# Altium project BMS Slave Device R1.5.PrjPcb
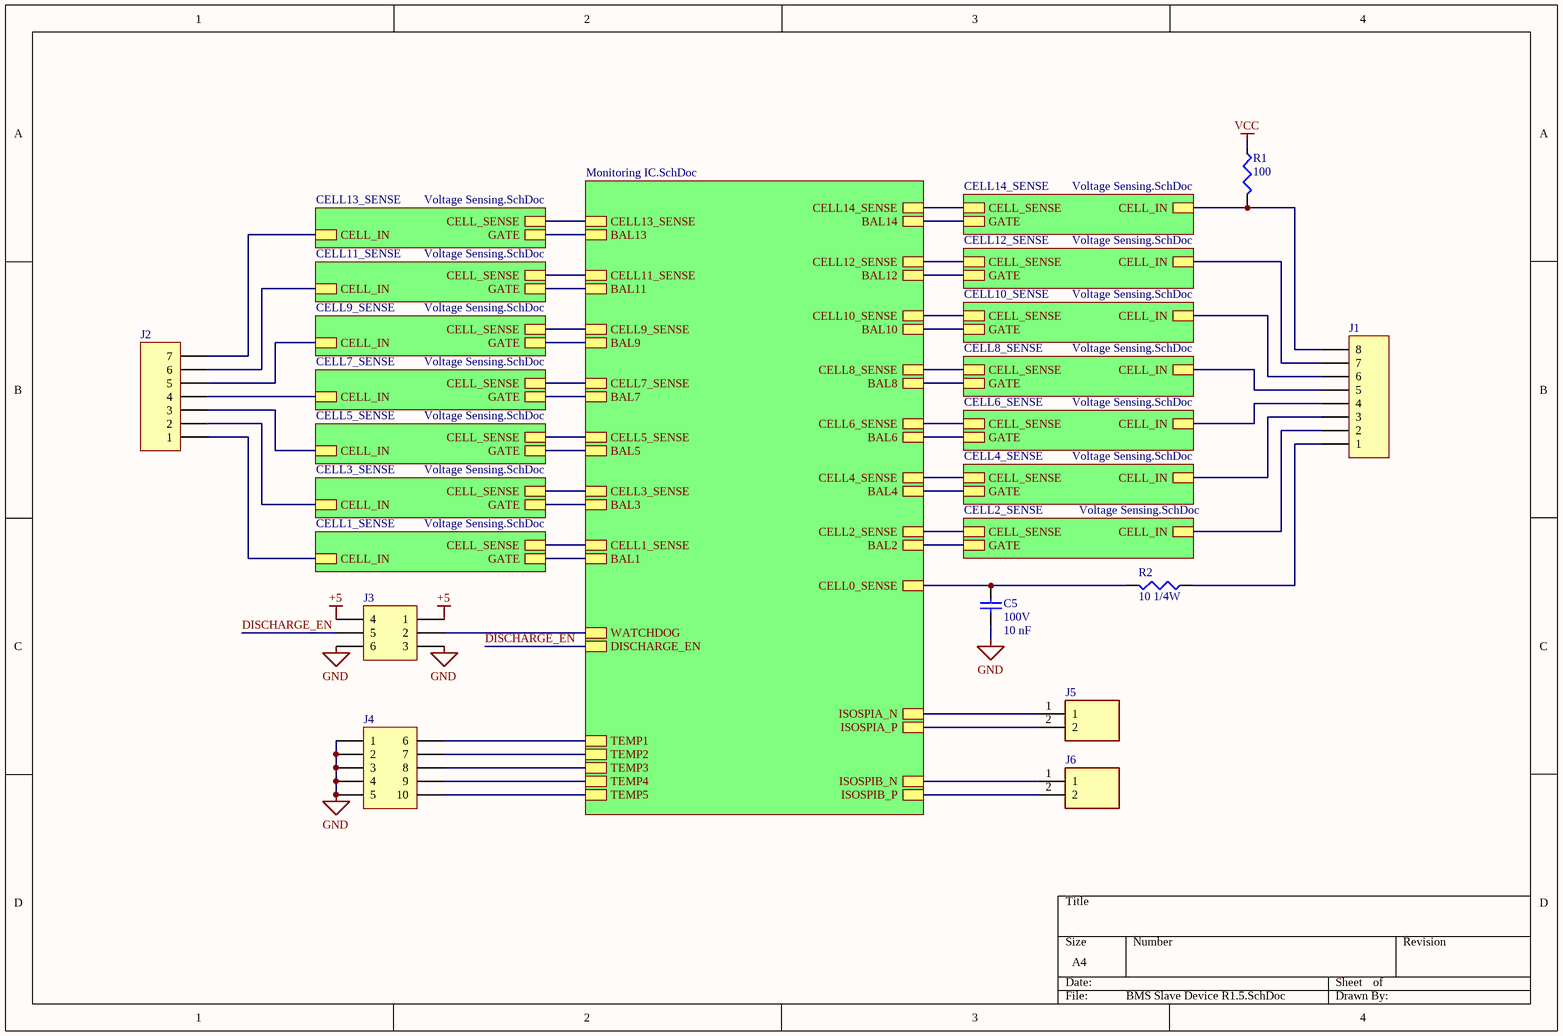
[diagram p0: BMS Slave Device R1.5.SchDoc]
2 sheets, 79 parts. Net scope: hierarchical (ports join the sheet entries above them; power ports are global).
Board file: BMS Slave Device R1.5.PcbDoc
Sheets:
  BMS Slave Device R1.5.SchDoc
    CELL14_SENSE = Voltage Sensing.SchDoc
    CELL12_SENSE = Voltage Sensing.SchDoc
    CELL10_SENSE = Voltage Sensing.SchDoc
    CELL8_SENSE = Voltage Sensing.SchDoc
    CELL6_SENSE = Voltage Sensing.SchDoc
    CELL4_SENSE = Voltage Sensing.SchDoc
    CELL2_SENSE = Voltage Sensing.SchDoc
    CELL13_SENSE = Voltage Sensing.SchDoc
    CELL11_SENSE = Voltage Sensing.SchDoc
    CELL9_SENSE = Voltage Sensing.SchDoc
    CELL7_SENSE = Voltage Sensing.SchDoc
    CELL5_SENSE = Voltage Sensing.SchDoc
    CELL3_SENSE = Voltage Sensing.SchDoc
    CELL1_SENSE = Voltage Sensing.SchDoc

## Sheet BMS Slave Device R1.5.SchDoc
size A4

### Parts
C5  100V  value 10 nF  [6-0805_N]
J1  Header 8  [HDR1X8]  (value not drawn)
J2  ODD CELLS  [HDR1X7]  (value not drawn)
J3  (no value)  [HDR2X3_CEN]
J4  THERMISTORS  [HDR2X5_CEN]  (value not drawn)
J5  B2B-XH-2__LF__SN_  [B2BXH2LFSN]  (value not drawn)
J6  B2B-XH-2__LF__SN_  [B2BXH2LFSN]  (value not drawn)
R1  value 100  [J1-0603]  (hidden comment: Res3)
R2  value 10 1/4W  [C1206]

### Sub-sheets
CELL1_SENSE = Voltage Sensing.SchDoc: CELL_SENSE, CELL_IN, GATE
CELL2_SENSE = Voltage Sensing.SchDoc: CELL_SENSE, CELL_IN, GATE
CELL3_SENSE = Voltage Sensing.SchDoc: CELL_SENSE, CELL_IN, GATE
CELL4_SENSE = Voltage Sensing.SchDoc: CELL_SENSE, CELL_IN, GATE
CELL5_SENSE = Voltage Sensing.SchDoc: CELL_SENSE, CELL_IN, GATE
CELL6_SENSE = Voltage Sensing.SchDoc: CELL_SENSE, CELL_IN, GATE
CELL7_SENSE = Voltage Sensing.SchDoc: CELL_SENSE, CELL_IN, GATE
CELL8_SENSE = Voltage Sensing.SchDoc: CELL_SENSE, CELL_IN, GATE
CELL9_SENSE = Voltage Sensing.SchDoc: CELL_SENSE, CELL_IN, GATE
CELL10_SENSE = Voltage Sensing.SchDoc: CELL_SENSE, CELL_IN, GATE
CELL11_SENSE = Voltage Sensing.SchDoc: CELL_SENSE, CELL_IN, GATE
CELL12_SENSE = Voltage Sensing.SchDoc: CELL_SENSE, CELL_IN, GATE
CELL13_SENSE = Voltage Sensing.SchDoc: CELL_SENSE, CELL_IN, GATE
CELL14_SENSE = Voltage Sensing.SchDoc: CELL_SENSE, CELL_IN, GATE
Designator = Monitoring IC.SchDoc (file not in this document): CELL14_SENSE, BAL14, CELL13_SENSE, BAL13, CELL12_SENSE, BAL12, CELL11_SENSE, BAL11, CELL10_SENSE, BAL10, CELL9_SENSE, BAL9, CELL8_SENSE, BAL8, CELL7_SENSE, BAL7, CELL6_SENSE, BAL6, CELL5_SENSE, BAL5, CELL4_SENSE, BAL4, CELL3_SENSE, BAL3, BAL2, CELL2_SENSE, CELL1_SENSE, BAL1, TEMP3, TEMP4, TEMP2, TEMP1, TEMP5, CELL0_SENSE, WATCHDOG, DISCHARGE_EN, ISOSPIA_N, ISOSPIB_P, ISOSPIB_N, ISOSPIA_P

### Nets
+5: J3.1 J3.4
GND: C5.1 J3.3 J3.6 J4.1 J4.2 J4.3 J4.4 J4.5
VCC: R1.2
DISCHARGE_EN: J3.5 ; sheet Designator/DISCHARGE_EN
NetC4A_2: sheet Designator/CELL1_SENSE, sheet CELL1_SENSE/CELL_SENSE
NetC4B_2: sheet Designator/CELL2_SENSE, sheet CELL2_SENSE/CELL_SENSE
NetC4C_2: sheet Designator/CELL3_SENSE, sheet CELL3_SENSE/CELL_SENSE
NetC4D_2: sheet Designator/CELL4_SENSE, sheet CELL4_SENSE/CELL_SENSE
NetC4E_2: sheet Designator/CELL5_SENSE, sheet CELL5_SENSE/CELL_SENSE
NetC4F_2: sheet Designator/CELL6_SENSE, sheet CELL6_SENSE/CELL_SENSE
NetC4G_2: sheet Designator/CELL7_SENSE, sheet CELL7_SENSE/CELL_SENSE
NetC4H_2: sheet Designator/CELL8_SENSE, sheet CELL8_SENSE/CELL_SENSE
NetC4I_2: sheet Designator/CELL9_SENSE, sheet CELL9_SENSE/CELL_SENSE
NetC4J_2: sheet Designator/CELL10_SENSE, sheet CELL10_SENSE/CELL_SENSE
NetC4K_2: sheet Designator/CELL11_SENSE, sheet CELL11_SENSE/CELL_SENSE
NetC4L_2: sheet Designator/CELL12_SENSE, sheet CELL12_SENSE/CELL_SENSE
NetC4M_2: sheet Designator/CELL13_SENSE, sheet CELL13_SENSE/CELL_SENSE
NetC4N_2: sheet Designator/CELL14_SENSE, sheet CELL14_SENSE/CELL_SENSE
NetC5_2: C5.2 R2.1 ; sheet Designator/CELL0_SENSE
NetD1A_2: sheet Designator/BAL1, sheet CELL1_SENSE/GATE
NetD1B_2: sheet Designator/BAL2, sheet CELL2_SENSE/GATE
NetD1C_2: sheet Designator/BAL3, sheet CELL3_SENSE/GATE
NetD1D_2: sheet Designator/BAL4, sheet CELL4_SENSE/GATE
NetD1E_2: sheet Designator/BAL5, sheet CELL5_SENSE/GATE
NetD1F_2: sheet Designator/BAL6, sheet CELL6_SENSE/GATE
NetD1G_2: sheet Designator/BAL7, sheet CELL7_SENSE/GATE
NetD1H_2: sheet Designator/BAL8, sheet CELL8_SENSE/GATE
NetD1I_2: sheet Designator/BAL9, sheet CELL9_SENSE/GATE
NetD1J_2: sheet Designator/BAL10, sheet CELL10_SENSE/GATE
NetD1K_2: sheet Designator/BAL11, sheet CELL11_SENSE/GATE
NetD1L_2: sheet Designator/BAL12, sheet CELL12_SENSE/GATE
NetD1M_2: sheet Designator/BAL13, sheet CELL13_SENSE/GATE
NetD1N_2: sheet Designator/BAL14, sheet CELL14_SENSE/GATE
NetJ1_1: J1.1 R2.2
NetJ1_2: J1.2 ; sheet CELL2_SENSE/CELL_IN
NetJ1_3: J1.3 ; sheet CELL4_SENSE/CELL_IN
NetJ1_4: J1.4 ; sheet CELL6_SENSE/CELL_IN
NetJ1_5: J1.5 ; sheet CELL8_SENSE/CELL_IN
NetJ1_6: J1.6 ; sheet CELL10_SENSE/CELL_IN
NetJ1_7: J1.7 ; sheet CELL12_SENSE/CELL_IN
NetJ1_8: J1.8 R1.1 ; sheet CELL14_SENSE/CELL_IN
NetJ2_1: J2.1 ; sheet CELL1_SENSE/CELL_IN
NetJ2_2: J2.2 ; sheet CELL3_SENSE/CELL_IN
NetJ2_3: J2.3 ; sheet CELL5_SENSE/CELL_IN
NetJ2_4: J2.4 ; sheet CELL7_SENSE/CELL_IN
NetJ2_5: J2.5 ; sheet CELL9_SENSE/CELL_IN
NetJ2_6: J2.6 ; sheet CELL11_SENSE/CELL_IN
NetJ2_7: J2.7 ; sheet CELL13_SENSE/CELL_IN
NetJ3_2: J3.2 ; sheet Designator/WATCHDOG
NetJ4_6: J4.6 ; sheet Designator/TEMP1
NetJ4_7: J4.7 ; sheet Designator/TEMP2
NetJ4_8: J4.8 ; sheet Designator/TEMP3
NetJ4_9: J4.9 ; sheet Designator/TEMP4
NetJ4_10: J4.10 ; sheet Designator/TEMP5
NetJ5_1: J5.1 ; sheet Designator/ISOSPIA_N
NetJ5_2: J5.2 ; sheet Designator/ISOSPIA_P
NetJ6_1: J6.1 ; sheet Designator/ISOSPIB_N
NetJ6_2: J6.2 ; sheet Designator/ISOSPIB_P

### Library data of the parts
C5 = Cap: Capacitor; Published: 8-Jun-2000; LatestRevisionDate: 17-Jul-2002; LatestRevisionNote: Re-released for DXP Platform.; PackageReference: RAD-0.3; Publisher: Altium Limited; PackageDescription: Radial Cap, Thru-Hole; 2 Leads; 0.3 in Pin Spacing
J1 = Header 8: Header, 8-Pin; LatestRevisionDate: 17-Jul-2002; LatestRevisionNote: Re-released for DXP Platform.; Publisher: Altium Limited
J2 = Header 7: LatestRevisionDate: 17-Jul-2002; LatestRevisionNote: Re-released for DXP Platform.; Publisher: Altium Limited
J3 = Header 3X2A: Header, 3-Pin, Dual row; LatestRevisionDate: 17-Jul-2002; LatestRevisionNote: Re-released for DXP Platform.; Publisher: Altium Limited
J4 = Header 5X2A: Header, 5-Pin, Dual row; LatestRevisionDate: 17-Jul-2002; LatestRevisionNote: Re-released for DXP Platform.; Publisher: Altium Limited
J5 J6 = B2B-XH-2__LF__SN_: Connector; Manufacturer_Name: JST (JAPAN SOLDERLESS TERMINALS); Manufacturer_Part_Number: B2B-XH-2 (LF)(SN); Datasheet Link: http://uk.rs-online.com/web/p/products/1755297; Height: 7mm; RS Part Number: 1755499; RS Price/Stock: http://uk.rs-online.com/web/p/products/1755499
R1 R2 = Res3: Resistor; Published: 8-Jun-2000; LatestRevisionDate: 29-May-2009; LatestRevisionNote: IPC-7351 Footprint Added.; PackageReference: J1-0603; Publisher: Altium Limited; PackageDescription: Chip Resistor

## Sheet Voltage Sensing.SchDoc
size A4
Used 14 times, as channels CELL14_SENSE, CELL12_SENSE, CELL10_SENSE, CELL8_SENSE, CELL6_SENSE, CELL4_SENSE, CELL2_SENSE, CELL13_SENSE, CELL11_SENSE, CELL9_SENSE, CELL7_SENSE, CELL5_SENSE, CELL3_SENSE, CELL1_SENSE. Parts and nets are listed once, with the designators drawn on the sheet.
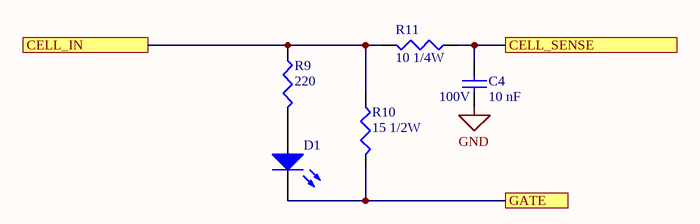
[diagram p1: Voltage Sensing.SchDoc]

### Parts
C4  100V  value 10 nF  [6-0805_N]
D1  LED2  [DIOC1608X06N]  (value not drawn)
R9  value 220  [J1-0603]  (hidden comment: Res3)
R10  value 15 1/2W  [14-1210]  (hidden comment: Res3)
R11  value 10 1/4W  [C1206]

### Ports
CELL_IN, CELL_SENSE, GATE

### Nets
GND: C4.1
CELL_IN: R9.1 R10.1 R11.2 ; port CELL_IN
CELL_SENSE: C4.2 R11.1 ; port CELL_SENSE
GATE: D1.2(K) R10.2 ; port GATE
NetD1_1: D1.1(A) R9.2

### Channels
CELL14_SENSE: designators end in N; ports CELL_IN=NetJ1_8 CELL_SENSE=NetC4N_2 GATE=NetD1N_2
CELL12_SENSE: designators end in L; ports CELL_IN=NetJ1_7 CELL_SENSE=NetC4L_2 GATE=NetD1L_2
CELL10_SENSE: designators end in J; ports CELL_IN=NetJ1_6 CELL_SENSE=NetC4J_2 GATE=NetD1J_2
CELL8_SENSE: designators end in H; ports CELL_IN=NetJ1_5 CELL_SENSE=NetC4H_2 GATE=NetD1H_2
CELL6_SENSE: designators end in F; ports CELL_IN=NetJ1_4 CELL_SENSE=NetC4F_2 GATE=NetD1F_2
CELL4_SENSE: designators end in D; ports CELL_IN=NetJ1_3 CELL_SENSE=NetC4D_2 GATE=NetD1D_2
CELL2_SENSE: designators end in B; ports CELL_IN=NetJ1_2 CELL_SENSE=NetC4B_2 GATE=NetD1B_2
CELL13_SENSE: designators end in M; ports CELL_IN=NetJ2_7 CELL_SENSE=NetC4M_2 GATE=NetD1M_2
CELL11_SENSE: designators end in K; ports CELL_IN=NetJ2_6 CELL_SENSE=NetC4K_2 GATE=NetD1K_2
CELL9_SENSE: designators end in I; ports CELL_IN=NetJ2_5 CELL_SENSE=NetC4I_2 GATE=NetD1I_2
CELL7_SENSE: designators end in G; ports CELL_IN=NetJ2_4 CELL_SENSE=NetC4G_2 GATE=NetD1G_2
CELL5_SENSE: designators end in E; ports CELL_IN=NetJ2_3 CELL_SENSE=NetC4E_2 GATE=NetD1E_2
CELL3_SENSE: designators end in C; ports CELL_IN=NetJ2_2 CELL_SENSE=NetC4C_2 GATE=NetD1C_2
CELL1_SENSE: designators end in A; ports CELL_IN=NetJ2_1 CELL_SENSE=NetC4A_2 GATE=NetD1A_2

### Library data of the parts
C4 = Cap: Capacitor; Published: 8-Jun-2000; LatestRevisionDate: 17-Jul-2002; LatestRevisionNote: Re-released for DXP Platform.; PackageReference: RAD-0.3; Publisher: Altium Limited; PackageDescription: Radial Cap, Thru-Hole; 2 Leads; 0.3 in Pin Spacing
D1 = LED2: Green LED; Published: 8-Jun-2000; LatestRevisionDate: 17-Jul-2002; LatestRevisionNote: Re-released for DXP Platform.; PackageVersion: Feb-2002; PackageReference: 3.2X1.6X1.1; Publisher: Altium Limited; PackageDescription: SM LED; 2 Flat Leads
R9-R11 = Res3: Resistor; Published: 8-Jun-2000; LatestRevisionDate: 29-May-2009; LatestRevisionNote: IPC-7351 Footprint Added.; PackageReference: J1-0603; Publisher: Altium Limited; PackageDescription: Chip Resistor

## Nets that join several sheets
GND: BMS Slave Device R1.5 (8 pins), CELL14_SENSE (C4N.1), CELL12_SENSE (C4L.1), CELL10_SENSE (C4J.1), CELL8_SENSE (C4H.1), CELL6_SENSE (C4F.1), CELL4_SENSE (C4D.1), CELL2_SENSE (C4B.1), CELL13_SENSE (C4M.1), CELL11_SENSE (C4K.1), CELL9_SENSE (C4I.1), CELL7_SENSE (C4G.1), CELL5_SENSE (C4E.1), CELL3_SENSE (C4C.1), CELL1_SENSE (C4A.1)
NetJ1_2: BMS Slave Device R1.5 (J1.2), CELL2_SENSE (R9B.1 R10B.1 R11B.2)
NetJ1_3: BMS Slave Device R1.5 (J1.3), CELL4_SENSE (R9D.1 R10D.1 R11D.2)
NetJ1_4: BMS Slave Device R1.5 (J1.4), CELL6_SENSE (R9F.1 R10F.1 R11F.2)
NetJ1_5: BMS Slave Device R1.5 (J1.5), CELL8_SENSE (R9H.1 R10H.1 R11H.2)
NetJ1_6: BMS Slave Device R1.5 (J1.6), CELL10_SENSE (R9J.1 R10J.1 R11J.2)
NetJ1_7: BMS Slave Device R1.5 (J1.7), CELL12_SENSE (R9L.1 R10L.1 R11L.2)
NetJ1_8: BMS Slave Device R1.5 (J1.8 R1.1), CELL14_SENSE (R9N.1 R10N.1 R11N.2)
NetJ2_1: BMS Slave Device R1.5 (J2.1), CELL1_SENSE (R9A.1 R10A.1 R11A.2)
NetJ2_2: BMS Slave Device R1.5 (J2.2), CELL3_SENSE (R9C.1 R10C.1 R11C.2)
NetJ2_3: BMS Slave Device R1.5 (J2.3), CELL5_SENSE (R9E.1 R10E.1 R11E.2)
NetJ2_4: BMS Slave Device R1.5 (J2.4), CELL7_SENSE (R9G.1 R10G.1 R11G.2)
NetJ2_5: BMS Slave Device R1.5 (J2.5), CELL9_SENSE (R9I.1 R10I.1 R11I.2)
NetJ2_6: BMS Slave Device R1.5 (J2.6), CELL11_SENSE (R9K.1 R10K.1 R11K.2)
NetJ2_7: BMS Slave Device R1.5 (J2.7), CELL13_SENSE (R9M.1 R10M.1 R11M.2)